# Altium project F4SDR.PrjPcb
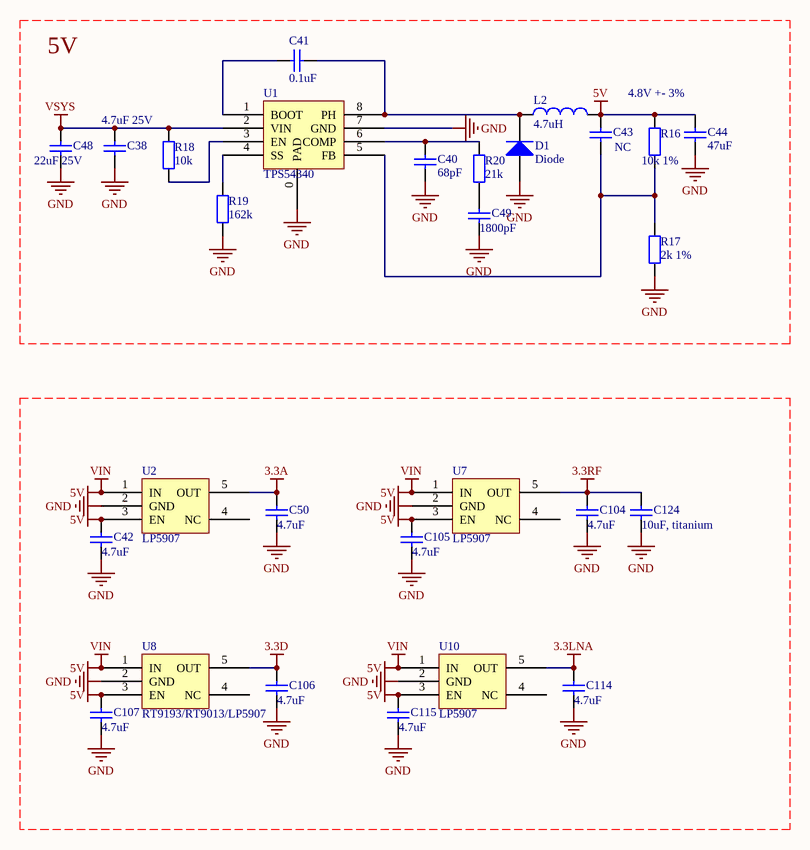
[diagram p0: power.SchDoc]
7 sheets, 238 parts. Net scope: flat (ports and power ports of the same name join across sheets).
Board file: F4SDR.PcbDoc
Sheets:
  power.SchDoc
  mcu.SchDoc
  IF.SchDoc
  MAX2829_RF.SchDoc
  PA.SchDoc
  USB_HS.SchDoc
  LNA.SchDoc

## Sheet power.SchDoc
size A4

### Parts
C38  value 4.7uF 25V  [0805]  (hidden comment: Cap)
C40  value 68pF  [0402]  (hidden comment: Cap)
C41  value 0.1uF  [0402]  (hidden comment: Cap)
C42  4.7uF  [0603]
C43  NC  [0402]
C44  value 47uF  [1210]  (hidden comment: Cap)
C48  value 22uF 25V  [1210]  (hidden comment: Cap)
C49  value 1800pF  [0402]  (hidden comment: Cap)
C50  4.7uF  [0603]
C104  4.7uF  [0603]
C105  4.7uF  [0603]
C106  4.7uF  [0603]
C107  4.7uF  [0603]
C114  4.7uF  [0603]
C115  4.7uF  [0603]
C124  10uF, titanium  [0805]
D1  Diode  [LC-SMB(DO-214AA)_S5]
L2  value 4.7uH  [L7022]  (hidden comment: Inductor)
R16  value 10k 1%  [0402]  (hidden comment: Res2)
R17  value 2k 1%  [0402]  (hidden comment: Res2)
R18  value 10k  [0402]  (hidden comment: Res2)
R19  value 162k  [0402]  (hidden comment: Res2)
R20  value 21k  [0402]  (hidden comment: Res2)
U1  TPS54340  [D8-Pad]
U2  LP5907  [SOT23-5]
U7  LP5907  [SOT23-5]
U8  RT9193/RT9013/LP5907  [SOT23-5]
U10  LP5907  [SOT23-5]

### Nets
3.3A: C50.2 U2.5(OUT)
3.3D: C106.2 U8.5(OUT)
3.3LNA: C114.2 U10.5(OUT)
3.3RF: C104.2 C124.2 U7.5(OUT)
5V: C42.2 C43.1 C44.1 C105.2 C107.2 C115.2 L2.2 R16.1 U2.1(IN) U2.3(EN) U7.1(IN) U7.3(EN) U8.1(IN) U8.3(EN) U10.1(IN) U10.3(EN)  [also labelled VIN]
GND: C38.2 C40.2 C42.1 C44.2 C48.2 C49.2 C50.1 C104.1 C105.1 C106.1 C107.1 C114.1 C115.1 C124.1 D1.1(A) R17.2 R19.2 U1.0(PAD) U1.7(GND) U2.2(GND) U7.2(GND) U8.2(GND) U10.2(GND)
VSYS: C38.1 C48.1 R18.1 U1.2(VIN)
NetC40_1: C40.1 R20.1 U1.6(COMP)
NetC41_1: C41.1 D1.2(K) L2.1 U1.8(PH)
NetC41_2: C41.2 U1.1(BOOT)
NetC43_2: C43.2 R16.2 R17.1 U1.5(FB)
NetC49_1: C49.1 R20.2
NetR18_2: R18.2 U1.3(EN)
NetR19_1: R19.1 U1.4(SS)

Not connected (* = marked no-connect by the designer): U2 4(NC); U7 4(NC); U8 4(NC); U10 4(NC)

### Notes on the sheet
- 5V
- 4.8V +- 3%

### Library data of the parts
C38 C40-C44 C48-C50 C104-C107 C114 C115 C124 = Cap: Capacitor; Published: 8-Jun-2000; LatestRevisionDate: 17-Jul-2002; LatestRevisionNote: Re-released for DXP Platform.; PackageReference: RAD-0.3; Publisher: Altium Limited; PackageDescription: Radial Cap, Thru-Hole; 2 Leads; 0.3 in Pin Spacing
D1 = Diode: Default Diode; Published: 8-Jun-2000; LatestRevisionDate: 17-Jul-2002; LatestRevisionNote: Re-released for DXP Platform.; PackageVersion: Sep-1996; PackageReference: SMC; Publisher: Altium Limited; PackageDescription: DO-214-AB/SMC; 2 C-Bend Leads; Body 7.9 x 5.9 mm, inc. leads (LxW); Code_JEDEC: DO-214-AB
L2 = Inductor: Code_IEC: 1005; Published: 8-Jun-2000; LatestRevisionDate: 29-May-2009; LatestRevisionNote: IPC-7351 Footprint Added.; PackageReference: 0402-A; Publisher: Altium Limited; PackageDescription: Chip Inductor; Code_JEITA: 0402
R16-R20 = Res2: Resistor; Published: 8-Jun-2000; LatestRevisionDate: 17-Jul-2002; LatestRevisionNote: Re-released for DXP Platform.; PackageReference: AXIAL-0.4; Publisher: Altium Limited; PackageDescription: Axial Device, Thru-Hole; 2 Leads; 0.4 in Pin Spacing
U8 = LP5907

## Sheet mcu.SchDoc
size A4
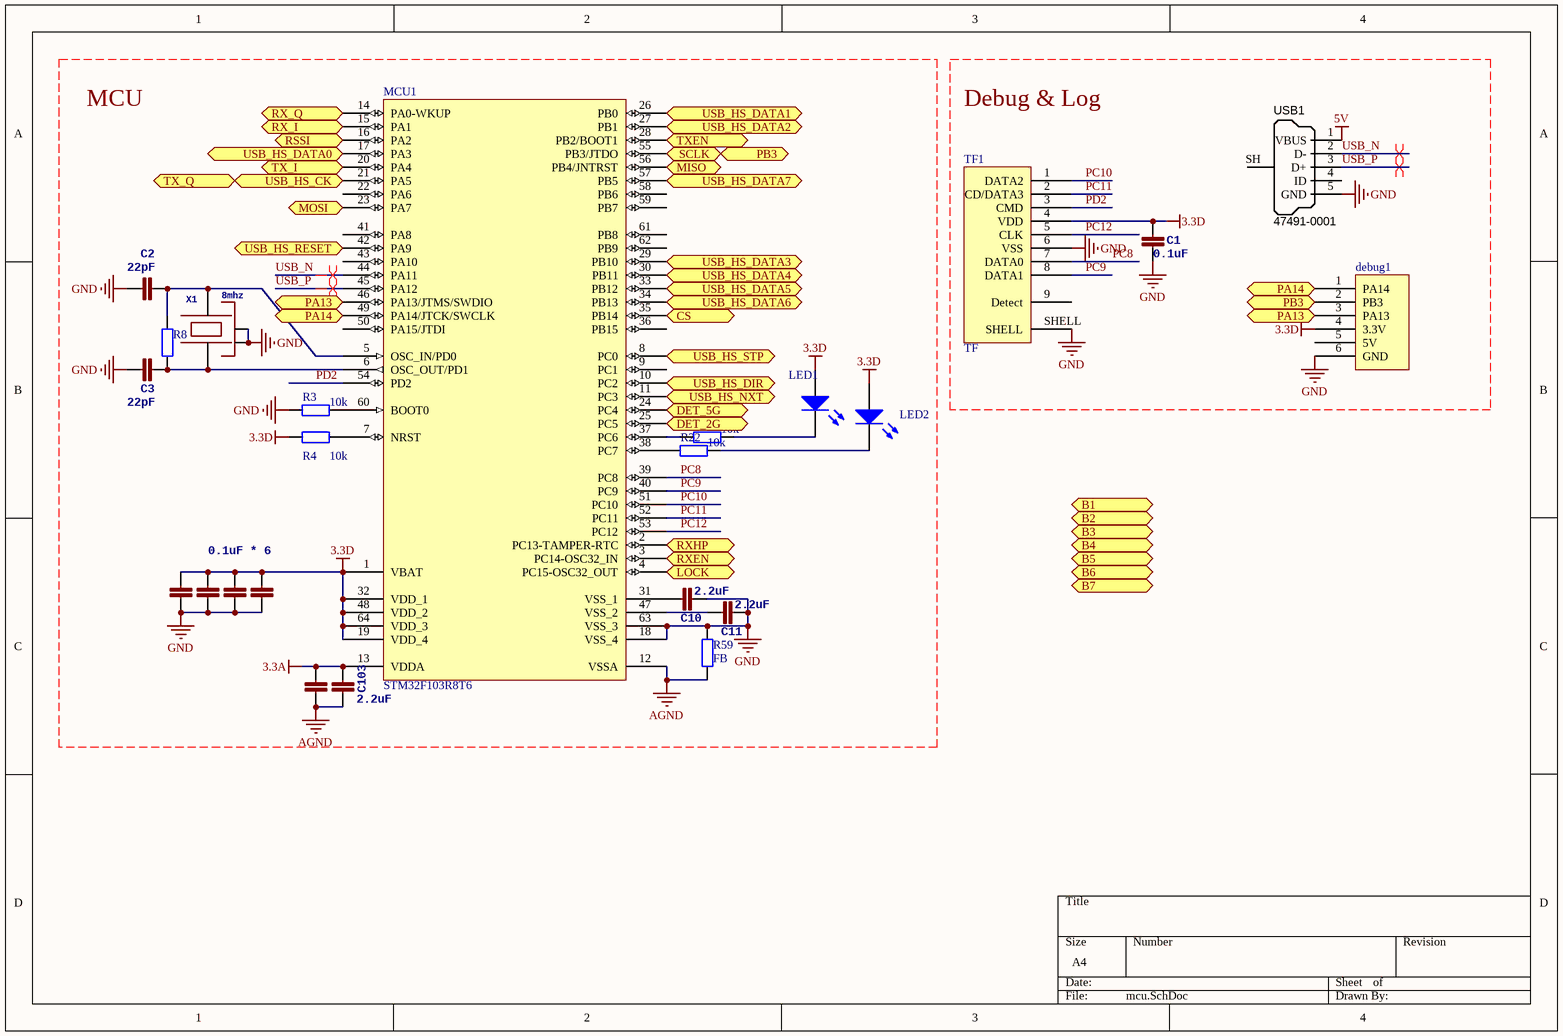
[diagram p1: mcu.SchDoc]

### Parts
C1  0.1uF  [0402]
C2  22pF  [0402]
C3  22pF  [0402]
C4  0.1uF * 6  [0402]
C5  1n  [0402]  (value not drawn)
C6  1n  [0402]  (value not drawn)
C7  1n  [0402]  (value not drawn)
C10  2.2uF  [0603]
C11  2.2uF  [0603]
C102  1n  [0402]  (value not drawn)
C103  2.2uF  [0603]
debug1  debug  [WFRSM125]  (value not drawn)
LED1  LED0  [0603]  (value not drawn)
LED2  LED0  [0603]  (value not drawn)
MCU1  STM32F103R8T6  [LQFP64_N]
R3  10k  [0402]
R4  10k  [0402]
R8  (no value)  [0402]
R21  10k  [0402]
R22  10k  [0402]
R59  FB  [0402]
TF1  TF  [TF]
USB1  Manufacturer Part Number 1: 47491-0001  [MICRO-YZX]  (hidden comment: USB Micro Type B)
X1  8mhz  [OSCILLATOR-3.2X2.5]

### Ports
B1, B2, B3, B4, B5, B6, B7, CS, DET_2G, DET_5G, LOCK, MISO, MOSI, PA13, PA14, PB3, RSSI, RX_I, RX_Q, RXEN, RXHP, SCLK, TX_I, TX_Q, TXEN, USB_HS_CK, USB_HS_DATA0, USB_HS_DATA1, USB_HS_DATA2, USB_HS_DATA3, USB_HS_DATA4, USB_HS_DATA5, USB_HS_DATA6, USB_HS_DATA7, USB_HS_DIR, USB_HS_NXT, USB_HS_RESET, USB_HS_STP

### Nets
3.3A: C102.2 C103.2 MCU1.13(VDDA)
3.3D: C1.2 C4.2 C5.2 C6.2 C7.2 debug1.4(3.3V) LED1.1(A) LED2.1(A) MCU1.1(VBAT) MCU1.19(VDD_4) MCU1.32(VDD_1) MCU1.48(VDD_2) MCU1.64(VDD_3) R4.2 TF1.4(VDD)
5V: USB1.1(VBUS)
AGND: C102.1 C103.1 MCU1.12(VSSA) R59.2
GND: C1.1 C2.2 C3.2 C4.1 C5.1 C6.1 C7.1 C10.2 C11.2 debug1.6(GND) MCU1.18(VSS_4) MCU1.63(VSS_3) R3.1 R59.1 TF1.6(VSS) TF1.SHELL USB1.5(GND) X1.2(NC_2) X1.4(NC_4)
PC8: MCU1.39(PC8) TF1.7(DATA0)
PC9: MCU1.40(PC9) TF1.8(DATA1)
PC10: MCU1.51(PC10) TF1.1(DATA2)
PC11: MCU1.52(PC11) TF1.2(CD/DATA3)
PC12: MCU1.53(PC12) TF1.5(CLK)
PD2: MCU1.54(PD2) TF1.3(CMD)
USB_N: MCU1.44(PA11) USB1.2(D-)
USB_P: MCU1.45(PA12) USB1.3(D+)
NetC2_1: C2.1 MCU1.5(OSC_IN/PD0) R8.2 X1.3
NetC3_1: C3.1 MCU1.6(OSC_OUT/PD1) R8.1 X1.1
NetC9_1: MCU1.15(PA1) ; port RX_I
NetC10_1: C10.1 MCU1.31(VSS_1)
NetC11_1: C11.1 MCU1.47(VSS_2)
NetC33_1: MCU1.25(PC5) ; port DET_2G
NetC58_1: MCU1.14(PA0-WKUP) ; port RX_Q
NetC123_1: MCU1.24(PC4) ; port DET_5G
Netdebug1_1: debug1.1(PA14) MCU1.49(PA14/JTCK/SWCLK) ; port PA14
Netdebug1_2: debug1.2(PB3) MCU1.55(PB3/JTDO) ; port SCLK, port PB3
Netdebug1_3: debug1.3(PA13) MCU1.46(PA13/JTMS/SWDIO) ; port PA13
NetLED1_2: LED1.2(K) R21.2
NetLED2_2: LED2.2(K) R22.2
NetMAX_13: MCU1.28(PB2/BOOT1) ; port TXEN
NetMAX_26: MCU1.23(PA7) ; port MOSI
NetMAX_28: MCU1.35(PB14) ; port CS
NetMAX_29: MCU1.4(PC15-OSC32_OUT) ; port LOCK
NetMAX_40: MCU1.16(PA2) ; port RSSI
NetMAX_41: MCU1.3(PC14-OSC32_IN) ; port RXEN
NetMAX_42: MCU1.2(PC13-TAMPER-RTC) ; port RXHP
NetMCU1_7: MCU1.7(NRST) R4.1
NetMCU1_8: MCU1.8(PC0) ; port USB_HS_STP
NetMCU1_10: MCU1.10(PC2) ; port USB_HS_DIR
NetMCU1_11: MCU1.11(PC3) ; port USB_HS_NXT
NetMCU1_17: MCU1.17(PA3) ; port USB_HS_DATA0
NetMCU1_20: MCU1.20(PA4) ; port TX_I
NetMCU1_21: MCU1.21(PA5) ; port USB_HS_CK, port TX_Q
NetMCU1_26: MCU1.26(PB0) ; port USB_HS_DATA1
NetMCU1_27: MCU1.27(PB1) ; port USB_HS_DATA2
NetMCU1_29: MCU1.29(PB10) ; port USB_HS_DATA3
NetMCU1_30: MCU1.30(PB11) ; port USB_HS_DATA4
NetMCU1_33: MCU1.33(PB12) ; port USB_HS_DATA5
NetMCU1_34: MCU1.34(PB13) ; port USB_HS_DATA6
NetMCU1_37: MCU1.37(PC6) R21.1
NetMCU1_38: MCU1.38(PC7) R22.1
NetMCU1_42: MCU1.42(PA9) ; port USB_HS_RESET
NetMCU1_56: MCU1.56(PB4/JNTRST) ; port MISO
NetMCU1_57: MCU1.57(PB5) ; port USB_HS_DATA7
NetMCU1_60: MCU1.60(BOOT0) R3.2

Not connected (* = marked no-connect by the designer): debug1 5(5V); MCU1 9(PC1) 22(PA6) 36(PB15) 41(PA8) 43(PA10) 50(PA15/JTDI) 58(PB6) 59(PB7) 61(PB8) 62(PB9); TF1 9(Detect); USB1 4(ID) SH(Shell)

### Layout directives
differential pair: USB_N, USB_P

### Notes on the sheet
- MCU
- Debug & Log

### Library data of the parts
C1-C7 C10 C11 C102 C103 = CAP0402-CAP: <b>Capacitor</b> / Standard 0603 ceramic capacitor, and 0.1" leaded capacitor.; PARTNO: CC0402ZRY5V7BB104
LED1 LED2 = LED0: Typical INFRARED GaAs LED; Published: 8-Jun-2000; LatestRevisionDate: 08-Jul-2005; LatestRevisionNote: Mech Layer 1 removed.; PackageReference: LED-0; Publisher: Altium Limited; PackageDescription: LED; 2 Leads
MCU1 = STM32F103R8T6: STM32 ARM-based 32-bit MCU with 64 Kbytes Flash, 64-pin LQFP, Industrial Temperature; Published: *; DatasheetVersion: *; PackageVersion: *; PackageReference: *; Publisher: *; PackageDescription: *; ComponentLink1Description: *; ComponentLink1URL: *; ComponentLink2Description: *; ComponentLink2URL: *
R3 R4 R8 R21 R22 R59 = Res2: Resistor; Value: 0Ohm; Published: 8-Jun-2000; LatestRevisionDate: 17-Jul-2002; LatestRevisionNote: Re-released for DXP Platform.; PackageReference: AXIAL-0.4; Publisher: Altium Limited; PackageDescription: Axial Device, Thru-Hole; 2 Leads; 0.4 in Pin Spacing
USB1 = USB_Micro_TypeB: Connector SMD USB Micro Type B middle mount; Manufacturer 1: Molex Inc; SCDType: undef; Package / Case: SMD; Supplier 1: Digi-Key; Supplier Part Number 1: WM17142CT-ND
X1 = OSCILLATOR-3.2X2.5: Crystal Oscillator in 3.2x2.5 SMD

## Sheet IF.SchDoc
size A3
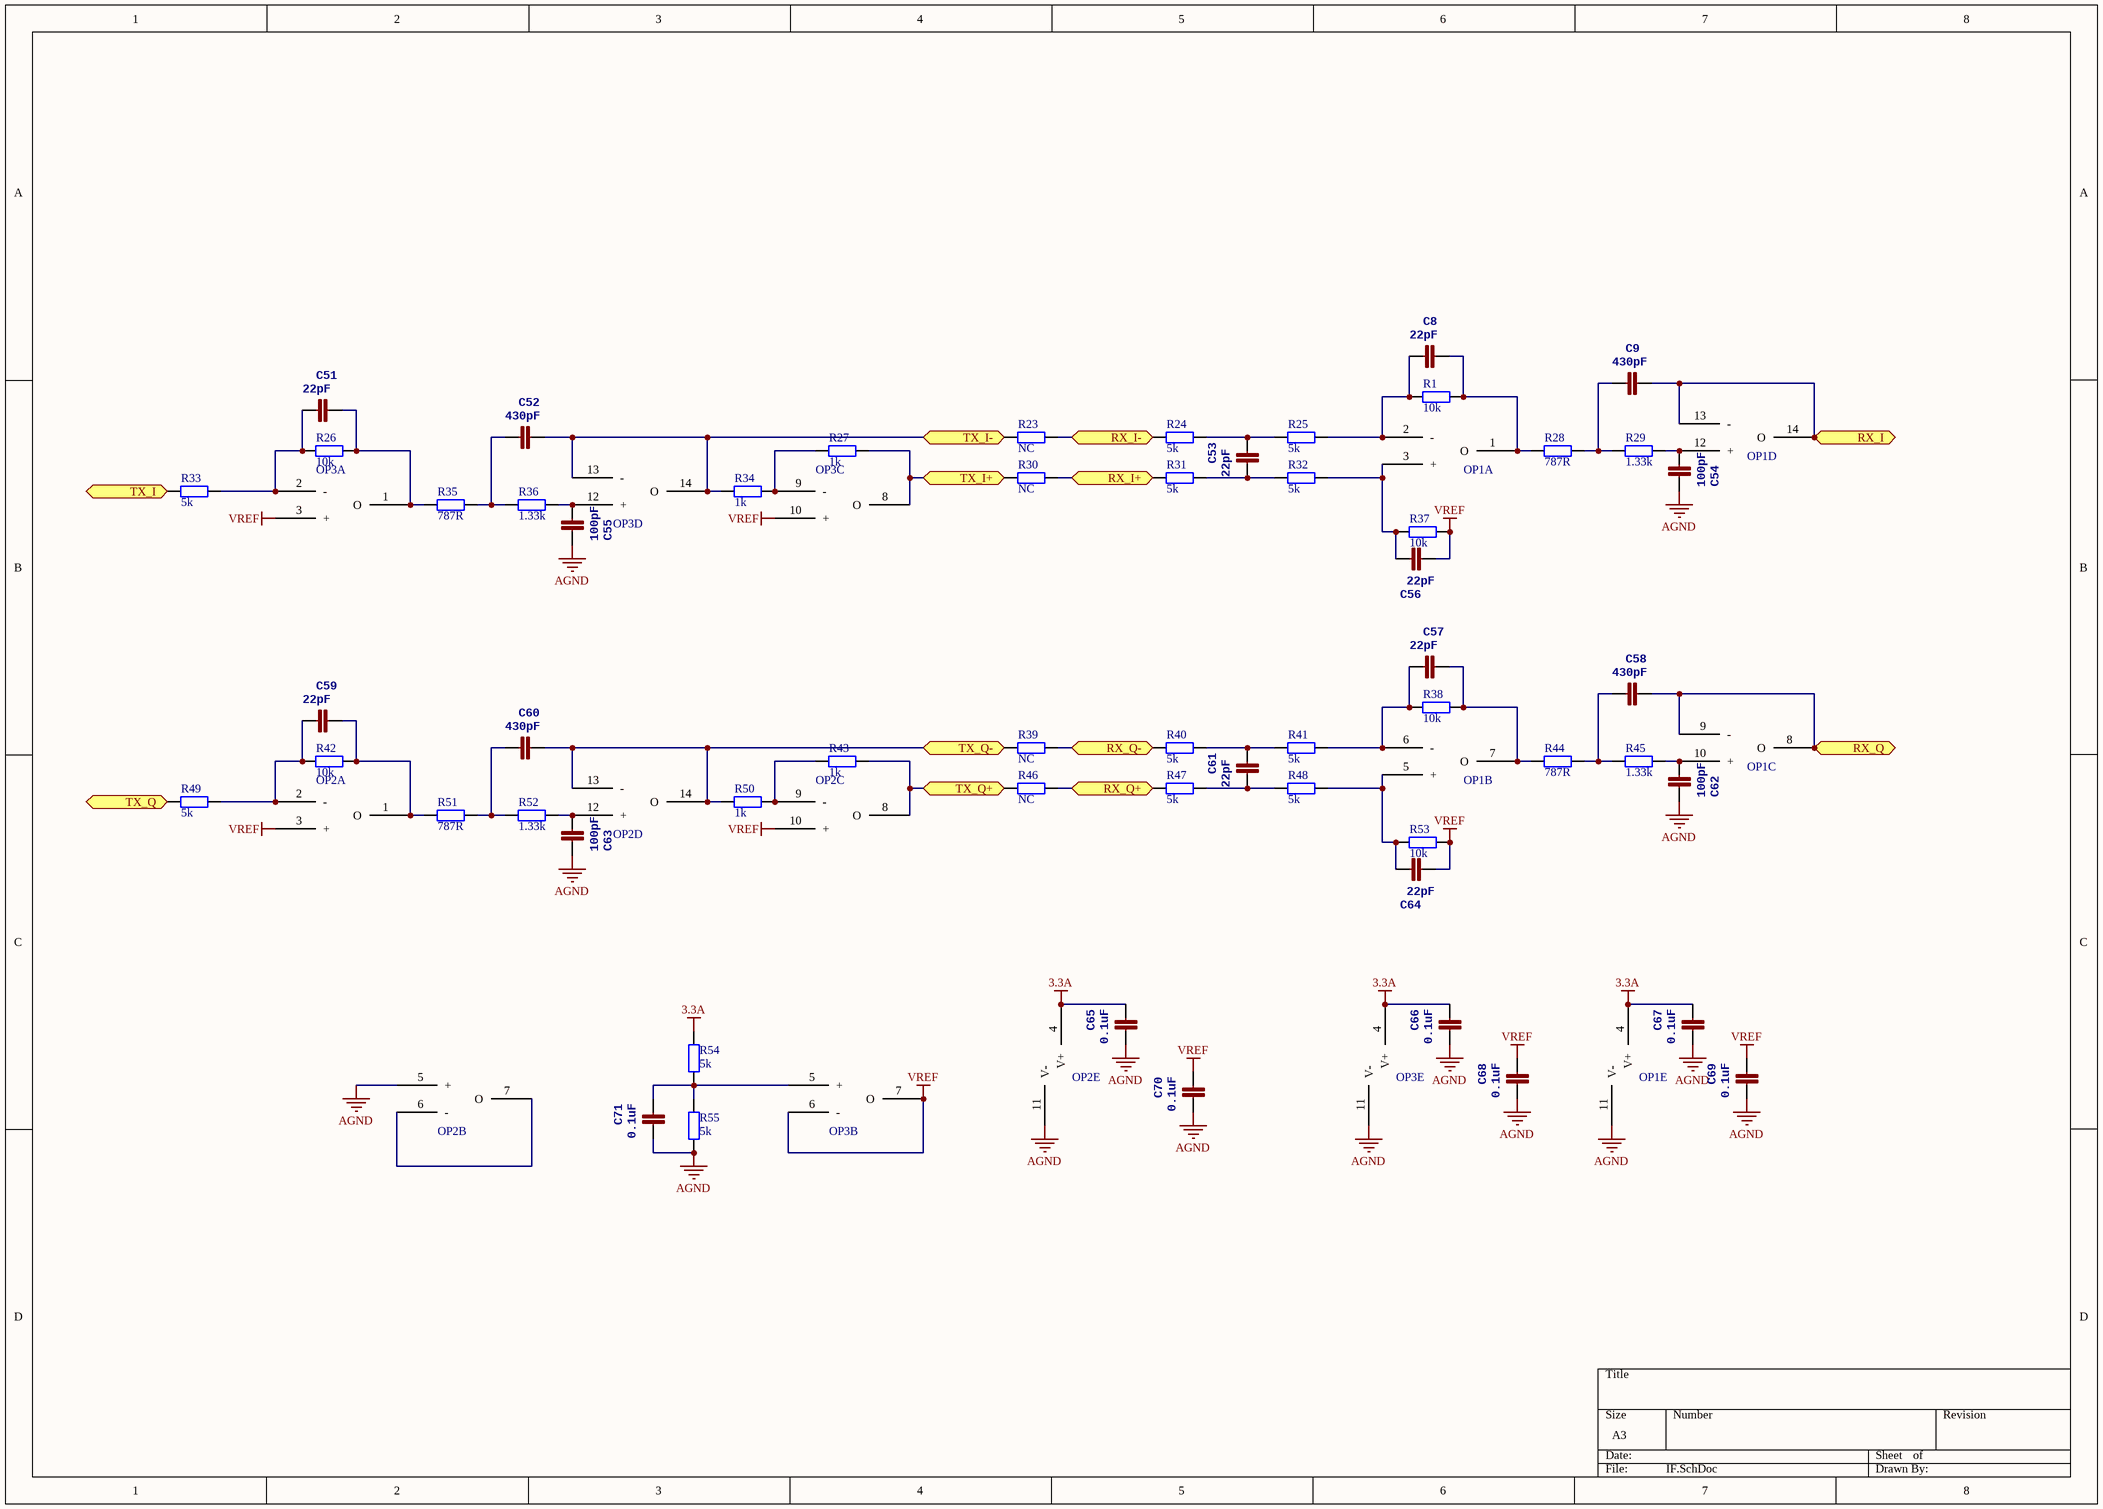
[diagram p2: IF.SchDoc]

### Parts
C8  22pF  [0402]
C9  430pF  [0402]
C51  22pF  [0402]
C52  430pF  [0402]
C53  22pF  [0402]
C54  100pF  [0402]
C55  100pF  [0402]
C56  22pF  [0402]
C57  22pF  [0402]
C58  430pF  [0402]
C59  22pF  [0402]
C60  430pF  [0402]
C61  22pF  [0402]
C62  100pF  [0402]
C63  100pF  [0402]
C64  22pF  [0402]
C65  0.1uF  [0402]
C66  0.1uF  [0402]
C67  0.1uF  [0402]
C68  0.1uF  [0402]
C69  0.1uF  [0402]
C70  0.1uF  [0402]
C71  0.1uF  [0402]
OP1  MCP6024  (value not drawn)  (parts A,B,C,D,E of 5)
OP2  MCP6024  (value not drawn)  (parts A,B,C,D,E of 5)
OP3  MCP6024  (value not drawn)  (parts A,B,C,D,E of 5)
R1  10k  [0402]
R23  NC  [0402]
R24  5k  [0402]
R25  5k  [0402]
R26  10k  [0402]
R27  1k  [0402]
R28  787R  [0402]
R29  1.33k  [0402]
R30  NC  [0402]
R31  5k  [0402]
R32  5k  [0402]
R33  5k  [0402]
R34  1k  [0402]
R35  787R  [0402]
R36  1.33k  [0402]
R37  10k  [0402]
R38  10k  [0402]
R39  NC  [0402]
R40  5k  [0402]
R41  5k  [0402]
R42  10k  [0402]
R43  1k  [0402]
R44  787R  [0402]
R45  1.33k  [0402]
R46  NC  [0402]
R47  5k  [0402]
R48  5k  [0402]
R49  5k  [0402]
R50  1k  [0402]
R51  787R  [0402]
R52  1.33k  [0402]
R53  10k  [0402]
R54  5k  [0402]
R55  5k  [0402]

### Ports
RX_I, RX_I+, RX_I-, RX_Q, RX_Q+, RX_Q-, TX_I, TX_I+, TX_I-, TX_Q, TX_Q+, TX_Q-

### Nets
3.3A: C65.1 C66.1 C67.1 OP1.4(V+) OP2.4(V+) OP3.4(V+) R54.1
AGND: C54.1 C55.1 C62.1 C63.1 C65.2 C66.2 C67.2 C68.2 C69.2 C70.2 C71.2 OP1.11(V-) OP2.5(+) OP2.11(V-) OP3.11(V-) R55.2
VREF: C56.2 C64.2 C68.1 C69.1 C70.1 OP2.3(+) OP2.10(+) OP3.3(+) OP3.6(-) OP3.7(O) OP3.10(+) R37.1 R53.1
NetC8_1: C8.1 OP1.1(O) R1.1 R28.2
NetC8_2: C8.2 OP1.2(-) R1.2 R25.1
NetC9_1: C9.1 OP1.13(-) OP1.14(O) ; port RX_I
NetC9_2: C9.2 R28.1 R29.2
NetC51_1: C51.1 OP3.1(O) R26.1 R35.2
NetC51_2: C51.2 OP3.2(-) R26.2 R33.1
NetC52_1: C52.1 OP3.13(-) OP3.14(O) R23.2 R34.2 ; port TX_I-
NetC52_2: C52.2 R35.1 R36.2
NetC53_1: C53.1 R24.1 R25.2
NetC53_2: C53.2 R31.1 R32.2
NetC54_2: C54.2 OP1.12(+) R29.1
NetC55_2: C55.2 OP3.12(+) R36.1
NetC56_1: C56.1 OP1.3(+) R32.1 R37.2
NetC57_1: C57.1 OP1.7(O) R38.1 R44.2
NetC57_2: C57.2 OP1.6(-) R38.2 R41.1
NetC58_1: C58.1 OP1.8(O) OP1.9(-) ; port RX_Q
NetC58_2: C58.2 R44.1 R45.2
NetC59_1: C59.1 OP2.1(O) R42.1 R51.2
NetC59_2: C59.2 OP2.2(-) R42.2 R49.1
NetC60_1: C60.1 OP2.13(-) OP2.14(O) R39.2 R50.2 ; port TX_Q-
NetC60_2: C60.2 R51.1 R52.2
NetC61_1: C61.1 R40.1 R41.2
NetC61_2: C61.2 R47.1 R48.2
NetC62_2: C62.2 OP1.10(+) R45.1
NetC63_2: C63.2 OP2.12(+) R52.1
NetC64_1: C64.1 OP1.5(+) R48.1 R53.2
NetC71_1: C71.1 OP3.5(+) R54.2 R55.1
NetMAX_16: OP3.8(O) R27.1 R30.2 ; port TX_I+
NetMAX_18: OP2.8(O) R43.1 R46.2 ; port TX_Q+
NetMAX_43: R39.1 R40.2 ; port RX_Q-
NetMAX_44: R46.1 R47.2 ; port RX_Q+
NetMAX_45: R23.1 R24.2 ; port RX_I-
NetMAX_46: R30.1 R31.2 ; port RX_I+
NetMCU1_20: R33.2 ; port TX_I
NetMCU1_21: R49.2 ; port TX_Q
NetOP2_6: OP2.6(-) OP2.7(O)
NetOP2_9: OP2.9(-) R43.2 R50.1
NetOP3_9: OP3.9(-) R27.2 R34.1

### Library data of the parts
C8 C9 C51-C71 = CAP0402-CAP: as C1 on sheet mcu
OP1-OP3 = OP-SOP14
R1 R23-R55 = Res2: Resistor; Published: 8-Jun-2000; LatestRevisionDate: 17-Jul-2002; LatestRevisionNote: Re-released for DXP Platform.; PackageReference: AXIAL-0.4; Publisher: Altium Limited; PackageDescription: Axial Device, Thru-Hole; 2 Leads; 0.4 in Pin Spacing

## Sheet MAX2829_RF.SchDoc
size A4
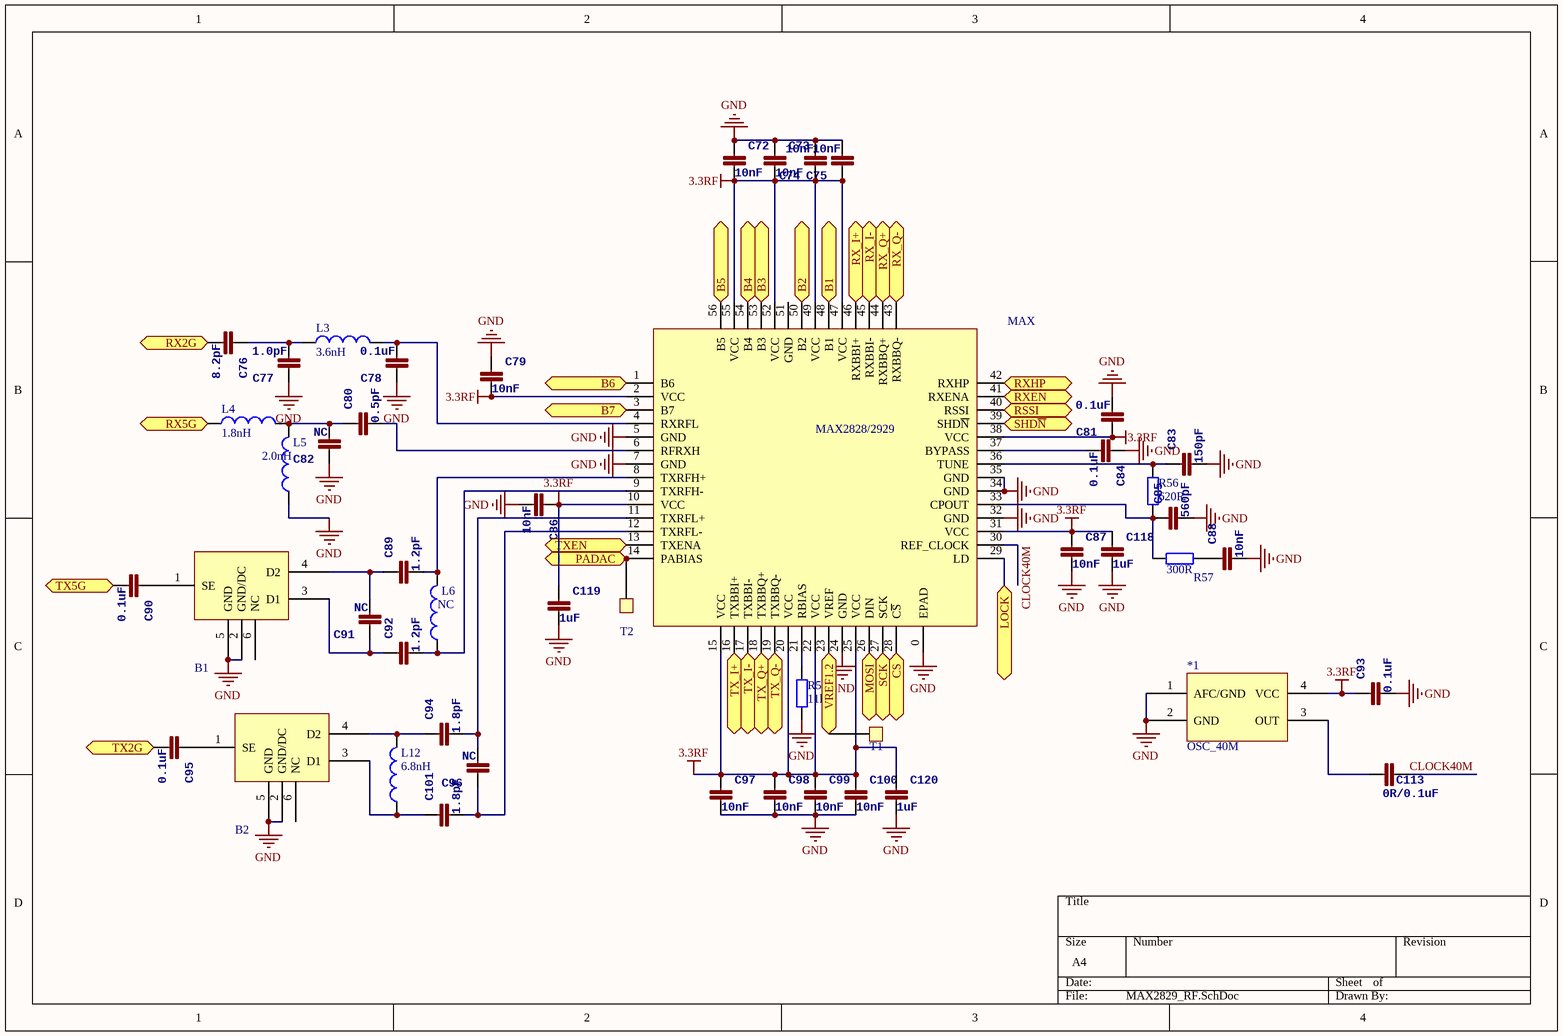
[diagram p3: MAX2829_RF.SchDoc]

### Parts
*1  OSC_40M  [TXC_7Q]
B1  Balun  [HHM1711D1/HHM1732B1]  (value not drawn)
B2  Balun  [HHM1711D1/HHM1732B1]  (value not drawn)
C72  10nF  [0402]
C73  10nF  [0402]
C74  10nF  [0402]
C75  10nF  [0402]
C76  8.2pF  [0402]
C77  1.0pF  [0402]
C78  0.1uF  [0402]
C79  10nF  [0402]
C80  0.5pF  [0402]
C81  0.1uF  [0402]
C82  NC  [0402]
C83  150pF  [0402]
C84  0.1uF  [0402]
C85  560pF  [0402]
C86  10nF  [0402]
C87  10nF  [0402]
C88  10nF  [0402]
C89  1.2pF  [0402]
C90  0.1uF  [0402]
C91  NC  [0402]
C92  1.2pF  [0402]
C93  0.1uF  [0402]
C94  1.8pF  [0402]
C95  0.1uF  [0402]
C96  NC  [0402]
C97  10nF  [0402]
C98  10nF  [0402]
C99  10nF  [0402]
C100  10nF  [0402]
C101  1.8pF  [0402]
C113  0R/0.1uF  [0402]
C118  1uF  [0603]
C119  1uF  [0603]
C120  1uF  [0603]
L3  value 3.6nH  [0402]  (hidden comment: Inductor)
L4  value 1.8nH  [0402]  (hidden comment: Inductor)
L5  2.0nH  [0402]
L6  NC  [0402]
L12  value 6.8nH  [0402]  (hidden comment: Inductor)
MAX  MAX2828/2929  [QFN_56\MAX2829]
R56  620R  [0402]
R57  300R  [0402]
R58  11k  [0402]
T1  TestPad  [TestPad - 1mm]  (value not drawn)
T2  TestPad  [TestPad - 1mm]  (value not drawn)

### Ports
B1, B2, B3, B4, B5, B6, B7, CS, LOCK, MOSI, PADAC, RSSI, RX2G, RX5G, RX_I+, RX_I-, RX_Q+, RX_Q-, RXEN, RXHP, SCK, SHD~{N}, TX2G, TX5G, TX_I+, TX_I-, TX_Q+, TX_Q-, TXEN, VREF1.2

### Nets
3.3RF: *1.4(VCC) C72.2 C73.2 C74.1 C75.1 C79.2 C81.1 C86.1 C87.1 C93.1 C97.1 C98.1 C99.1 C100.1 C118.1 C119.1 C120.1 MAX.2(VCC) MAX.10(VCC) MAX.15(VCC) MAX.20(VCC) MAX.22(VCC) MAX.25(VCC) MAX.31(VCC) MAX.38(VCC) MAX.47(VCC) MAX.49(VCC) MAX.52(VCC) MAX.55(VCC)
GND: *1.1(AFC/GND) *1.2(GND) B1.2(GND/DC) B1.5(GND) B2.2(GND/DC) B2.5(GND) C72.1 C73.1 C74.2 C75.2 C77.1 C78.1 C79.1 C81.2 C82.1 C83.2 C84.1 C85.2 C86.2 C87.2 C88.2 C93.2 C97.2 C98.2 C99.2 C100.2 C118.2 C119.2 C120.2 L5.1 MAX.0(EPAD) MAX.5(GND) MAX.7(GND) MAX.24(GND) MAX.32(GND) MAX.34(GND) MAX.35(GND) R58.1
CLOCK40M: C113.2 MAX.30(REF_CLOCK)
Net*1_3: *1.3(OUT) C113.1
NetB1_1: B1.1(SE) C90.1
NetB1_3: B1.3(D1) C91.1 C92.1
NetB1_4: B1.4(D2) C89.1 C91.2
NetB2_1: B2.1(SE) C95.1
NetB2_3: B2.3(D1) C101.1 L12.1
NetB2_4: B2.4(D2) C94.1 L12.2
NetC18_1: C76.2 ; port RX2G
NetC47_2: L4.1 ; port RX5G
NetC52_1: MAX.17(TXBBI-) ; port TX_I-
NetC60_1: MAX.19(TXBBQ-) ; port TX_Q-
NetC76_1: C76.1 C77.2 L3.1
NetC78_2: C78.2 L3.2 MAX.4(RXRFL)
NetC80_1: C80.1 C82.2 L4.2 L5.2
NetC80_2: C80.2 MAX.6(RFRXH)
NetC83_1: C83.1 MAX.36(TUNE) R56.1
NetC84_2: C84.2 MAX.37(BYPASS)
NetC85_1: C85.1 MAX.33(CPOUT) R56.2 R57.1
NetC88_1: C88.1 R57.2
NetC89_2: C89.2 L6.2 MAX.8(TXRFH+)
NetC90_2: C90.2 ; port TX5G
NetC92_2: C92.2 L6.1 MAX.9(TXRFH-)
NetC94_2: C94.2 C96.2 MAX.11(TXRFL+)
NetC95_2: C95.2 ; port TX2G
NetC96_1: C96.1 C101.2 MAX.12(TXRFL-)
NetMAX_1: MAX.1(B6) ; port B6
NetMAX_3: MAX.3(B7) ; port B7
NetMAX_13: MAX.13(TXENA) ; port TXEN
NetMAX_14: MAX.14(PABIAS) T2.1 ; port PADAC
NetMAX_16: MAX.16(TXBBI+) ; port TX_I+
NetMAX_18: MAX.18(TXBBQ+) ; port TX_Q+
NetMAX_21: MAX.21(RBIAS) R58.2
NetMAX_23: MAX.23(VREF) T1.1 ; port VREF1.2
NetMAX_26: MAX.26(DIN) ; port MOSI
NetMAX_27: MAX.27(SCK) ; port SCK
NetMAX_28: MAX.28(C~{S}) ; port CS
NetMAX_29: MAX.29(LD) ; port LOCK
NetMAX_39: MAX.39(SHD~{N}) ; port SHD~{N}
NetMAX_40: MAX.40(RSSI) ; port RSSI
NetMAX_41: MAX.41(RXENA) ; port RXEN
NetMAX_42: MAX.42(RXHP) ; port RXHP
NetMAX_43: MAX.43(RXBBQ-) ; port RX_Q-
NetMAX_44: MAX.44(RXBBQ+) ; port RX_Q+
NetMAX_45: MAX.45(RXBBI-) ; port RX_I-
NetMAX_46: MAX.46(RXBBI+) ; port RX_I+
NetMAX_48: MAX.48(B1) ; port B1
NetMAX_50: MAX.50(B2) ; port B2
NetMAX_53: MAX.53(B3) ; port B3
NetMAX_54: MAX.54(B4) ; port B4
NetMAX_56: MAX.56(B5) ; port B5

Not connected (* = marked no-connect by the designer): B1 6(NC); B2 6(NC); MAX 51(GND)

### Library data of the parts
C72-C101 C113 C118-C120 = CAP0402-CAP: as C1 on sheet mcu
L3-L6 L12 = Inductor: Code_IEC: 1005; Published: 8-Jun-2000; LatestRevisionDate: 29-May-2009; LatestRevisionNote: IPC-7351 Footprint Added.; PackageReference: 0402-A; Publisher: Altium Limited; PackageDescription: Chip Inductor; Code_JEITA: 0402
R56-R58 = Res2: Resistor; Published: 8-Jun-2000; LatestRevisionDate: 17-Jul-2002; LatestRevisionNote: Re-released for DXP Platform.; PackageReference: AXIAL-0.4; Publisher: Altium Limited; PackageDescription: Axial Device, Thru-Hole; 2 Leads; 0.4 in Pin Spacing

## Sheet PA.SchDoc
size A4
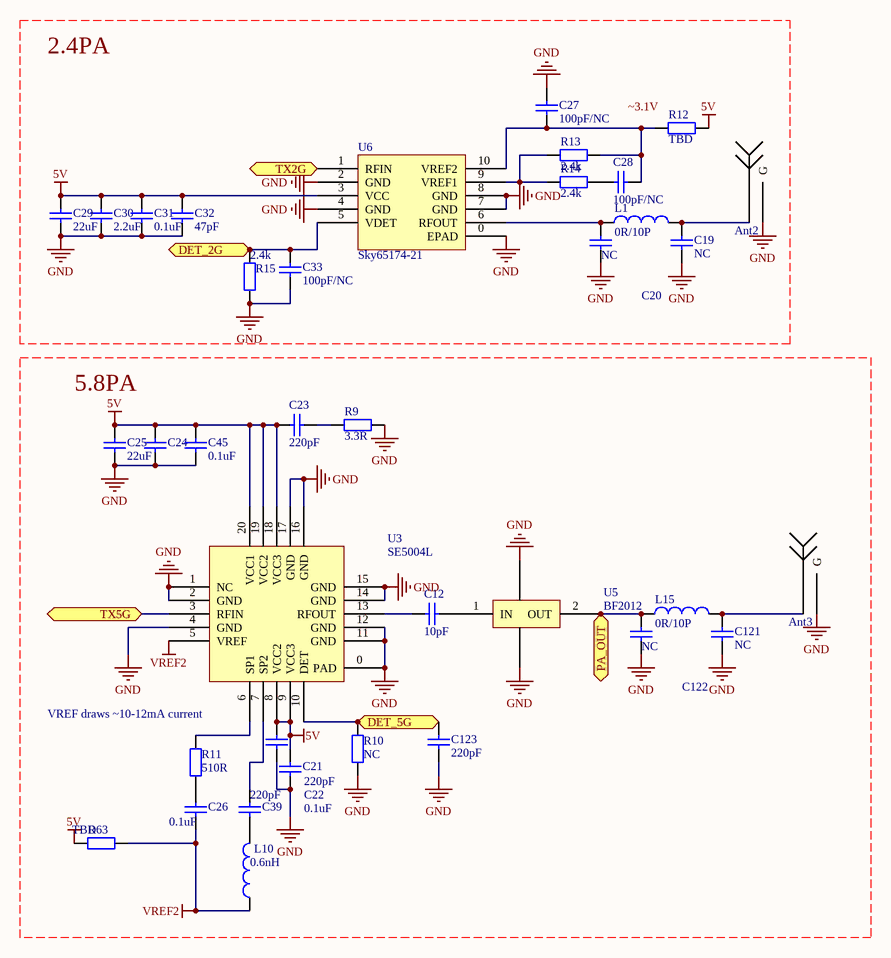
[diagram p4: PA.SchDoc]

### Parts
Ant2  Antenna  [SMA-2]  (value not drawn)
Ant3  Antenna  [SMA-2]  (value not drawn)
C12  value 10pF  [0402]  (hidden comment: Cap)
C19  value NC  [0402]  (hidden comment: Cap)
C20  value NC  [0402]  (hidden comment: Cap)
C21  value 0.1uF  [0402]  (hidden comment: Cap)
C22  value 220pF  [0402]  (hidden comment: Cap)
C23  value 220pF  [0402]  (hidden comment: Cap)
C24  1uF  [0603]  (value not drawn)
C25  value 22uF  [0805]  (hidden comment: Cap)
C26  value 0.1uF  [0402]  (hidden comment: Cap)
C27  value 100pF/NC  [0402]  (hidden comment: Cap)
C28  value 100pF/NC  [0402]  (hidden comment: Cap)
C29  value 22uF  [0805]  (hidden comment: Cap)
C30  value 2.2uF  [0603]  (hidden comment: Cap)
C31  value 0.1uF  [0402]  (hidden comment: Cap)
C32  value 47pF  [0402]  (hidden comment: Cap)
C33  value 100pF/NC  [0402]  (hidden comment: Cap)
C39  value 220pF  [0402]  (hidden comment: Cap)
C45  value 0.1uF  [0402]  (hidden comment: Cap)
C121  value NC  [0402]  (hidden comment: Cap)
C122  value NC  [0402]  (hidden comment: Cap)
C123  value 220pF  [0402]  (hidden comment: Cap)
L1  value 0R/10P  [0402]  (hidden comment: Inductor)
L10  value 0.6nH  [0402]  (hidden comment: Inductor)
L15  value 0R/10P  [0402]  (hidden comment: Inductor)
R9  value 3.3R  [0402]  (hidden comment: Res2)
R10  value NC  [0402]  (hidden comment: Res2)
R11  value 510R  [0402]  (hidden comment: Res2)
R12  value TBD  [0402]  (hidden comment: Res2)
R13  value 2.4k  [0402]  (hidden comment: Res2)
R14  value 2.4k  [0402]  (hidden comment: Res2)
R15  value 2.4k  [0402]  (hidden comment: Res2)
R63  TBD  [0603]
U3  SE5004L  [SE5004L]
U5  BF2012  [LFB2H5]
U6  Sky65174-21  [SKY65174-21]

### Ports
DET_2G, DET_5G, PA_OUT, TX2G, TX5G

### Nets
5V: C21.2 C22.2 C23.2 C24.1 C25.2 C29.1 C30.1 C31.1 C32.1 C45.1 R12.1 R63.2 U3.8(VCC2) U3.9(VCC3) U3.18(VCC3) U3.19(VCC2) U3.20(VCC1) U6.3(VCC)
GND: Ant2.GND(G) Ant3.GND(G) C19.2 C20.2 C21.1 C22.1 C24.2 C25.1 C27.1 C29.2 C30.2 C31.2 C32.2 C33.2 C45.2 C121.2 C122.2 C123.2 R9.1 R10.1 R15.1 U3.0(PAD) U3.1(NC) U3.2(GND) U3.4(GND) U3.11(GND) U3.12(GND) U3.14(GND) U3.15(GND) U3.16(GND) U3.17(GND) U5.0(GND) U6.0(EPAD) U6.2(GND) U6.4(GND) U6.7(GND) U6.8(GND)
VREF2: C26.1 L10.1 R63.1 U3.5(VREF)
NetAnt2_1: Ant2.1 C19.1 L1.2
NetAnt3_1: Ant3.1 C121.1 L15.2
NetC12_1: C12.1 U3.13(RFOUT)
NetC12_2: C12.2 U5.1(IN)
NetC20_1: C20.1 L1.1 U6.6(RFOUT)
NetC23_1: C23.1 R9.2
NetC26_2: C26.2 R11.1
NetC27_2: C27.2 C28.2 R12.2 R13.1 U6.10(VREF2)
NetC28_1: C28.1 R14.1
NetC33_1: C33.1 R15.2 U6.5(VDET) ; port DET_2G
NetC39_1: C39.1 L10.2
NetC39_2: C39.2 U3.7(SP2)
NetC90_2: U3.3(RFIN) ; port TX5G
NetC95_2: U6.1(RFIN) ; port TX2G
NetC122_1: C122.1 L15.1 U5.2(OUT) ; port PA_OUT
NetC123_1: C123.1 R10.2 U3.10(DET) ; port DET_5G
NetR11_2: R11.2 U3.6(SP1)
NetR13_2: R13.2 R14.2 U6.9(VREF1)

### Notes on the sheet
- 2.4PA
- 5.8PA
- VREF draws ~10-12mA current
- Labels drawn without touching a wire or pin: ~3.1V

### Library data of the parts
C12 C19-C33 C39 C45 C121-C123 = Cap: Capacitor; Published: 8-Jun-2000; LatestRevisionDate: 17-Jul-2002; LatestRevisionNote: Re-released for DXP Platform.; PackageReference: RAD-0.3; Publisher: Altium Limited; PackageDescription: Radial Cap, Thru-Hole; 2 Leads; 0.3 in Pin Spacing
L1 L10 L15 = Inductor: Code_IEC: 1005; Published: 8-Jun-2000; LatestRevisionDate: 29-May-2009; LatestRevisionNote: IPC-7351 Footprint Added.; PackageReference: 0402-A; Publisher: Altium Limited; PackageDescription: Chip Inductor; Code_JEITA: 0402
R9-R15 R63 = Res2: Resistor; Published: 8-Jun-2000; LatestRevisionDate: 17-Jul-2002; LatestRevisionNote: Re-released for DXP Platform.; PackageReference: AXIAL-0.4; Publisher: Altium Limited; PackageDescription: Axial Device, Thru-Hole; 2 Leads; 0.4 in Pin Spacing

## Sheet USB_HS.SchDoc
size A4
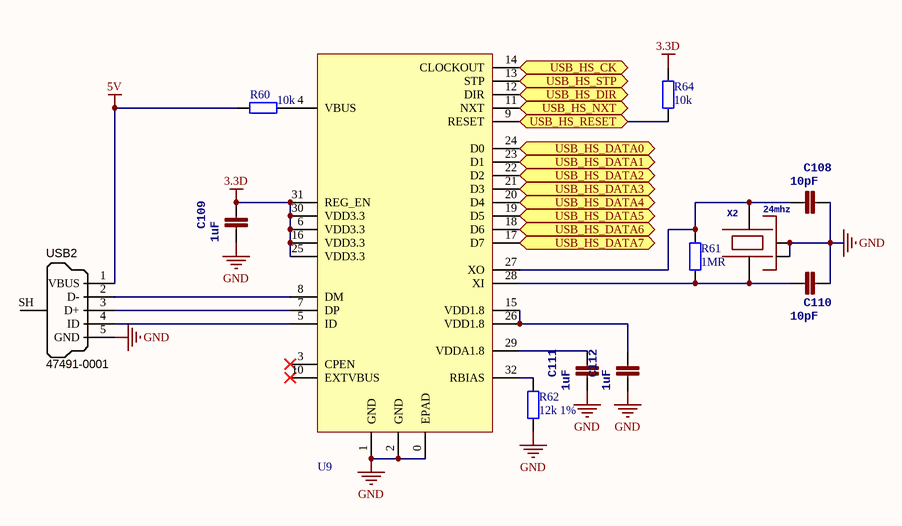
[diagram p5: USB_HS.SchDoc]

### Parts
C108  10pF  [0402]
C109  1uF  [0402]
C110  10pF  [0402]
C111  1uF  [0402]
C112  1uF  [0402]
R60  10k  [0402]
R61  1MR  [0402]
R62  12k 1%  [0402]
R64  10k  [0402]
U9  USB3300_1  [USB3300]  (value not drawn)
USB2  Manufacturer Part Number 1: 47491-0001  [MICRO-YZX]  (hidden comment: USB Micro Type B)
X2  24mhz  [OSCILLATOR-3.2X2.5]

### Ports
USB_HS_CK, USB_HS_DATA0, USB_HS_DATA1, USB_HS_DATA2, USB_HS_DATA3, USB_HS_DATA4, USB_HS_DATA5, USB_HS_DATA6, USB_HS_DATA7, USB_HS_DIR, USB_HS_NXT, USB_HS_RESET, USB_HS_STP

### Nets
3.3D: C109.1 R64.2 U9.6(VDD3.3) U9.16(VDD3.3) U9.25(VDD3.3) U9.30(VDD3.3) U9.31(REG_EN)
5V: R60.1 USB2.1(VBUS)
GND: C108.1 C109.2 C110.1 C111.2 C112.2 R62.1 U9.0(EPAD) U9.1(GND) U9.2(GND) USB2.5(GND) X2.2(NC_2) X2.4(NC_4)
NetC108_2: C108.2 R61.2 U9.27(XO) X2.3
NetC110_2: C110.2 R61.1 U9.28(XI) X2.1
NetC111_1: C111.1 U9.29(VDDA1.8)
NetC112_1: C112.1 U9.15(VDD1.8) U9.26(VDD1.8)
NetMCU1_8: U9.13(STP) ; port USB_HS_STP
NetMCU1_10: U9.12(DIR) ; port USB_HS_DIR
NetMCU1_11: U9.11(NXT) ; port USB_HS_NXT
NetMCU1_17: U9.24(D0) ; port USB_HS_DATA0
NetMCU1_21: U9.14(CLOCKOUT) ; port USB_HS_CK
NetMCU1_26: U9.23(D1) ; port USB_HS_DATA1
NetMCU1_27: U9.22(D2) ; port USB_HS_DATA2
NetMCU1_29: U9.21(D3) ; port USB_HS_DATA3
NetMCU1_30: U9.20(D4) ; port USB_HS_DATA4
NetMCU1_33: U9.19(D5) ; port USB_HS_DATA5
NetMCU1_34: U9.18(D6) ; port USB_HS_DATA6
NetMCU1_42: R64.1 U9.9(RESET) ; port USB_HS_RESET
NetMCU1_57: U9.17(D7) ; port USB_HS_DATA7
NetR60_2: R60.2 U9.4(VBUS)
NetR62_2: R62.2 U9.32(RBIAS)
NetU9_5: U9.5(ID) USB2.4(ID)
NetU9_7: U9.7(DP) USB2.3(D+)
NetU9_8: U9.8(DM) USB2.2(D-)

Not connected (* = marked no-connect by the designer): U9 3(CPEN)* 10(EXTVBUS)*; USB2 SH(Shell)

### Library data of the parts
C108-C112 = CAP0402-CAP: as C1 on sheet mcu
R60-R62 R64 = Res2: Resistor; Value: 0Ohm; Published: 8-Jun-2000; LatestRevisionDate: 17-Jul-2002; LatestRevisionNote: Re-released for DXP Platform.; PackageReference: AXIAL-0.4; Publisher: Altium Limited; PackageDescription: Axial Device, Thru-Hole; 2 Leads; 0.4 in Pin Spacing
USB2 = USB_Micro_TypeB: as USB1 on sheet mcu; Package / Case: SMD; Supplier 1: Digi-Key; Supplier Part Number 1: WM17142CT-ND
X2 = OSCILLATOR-3.2X2.5: Crystal Oscillator in 3.2x2.5 SMD

## Sheet LNA.SchDoc
size A4
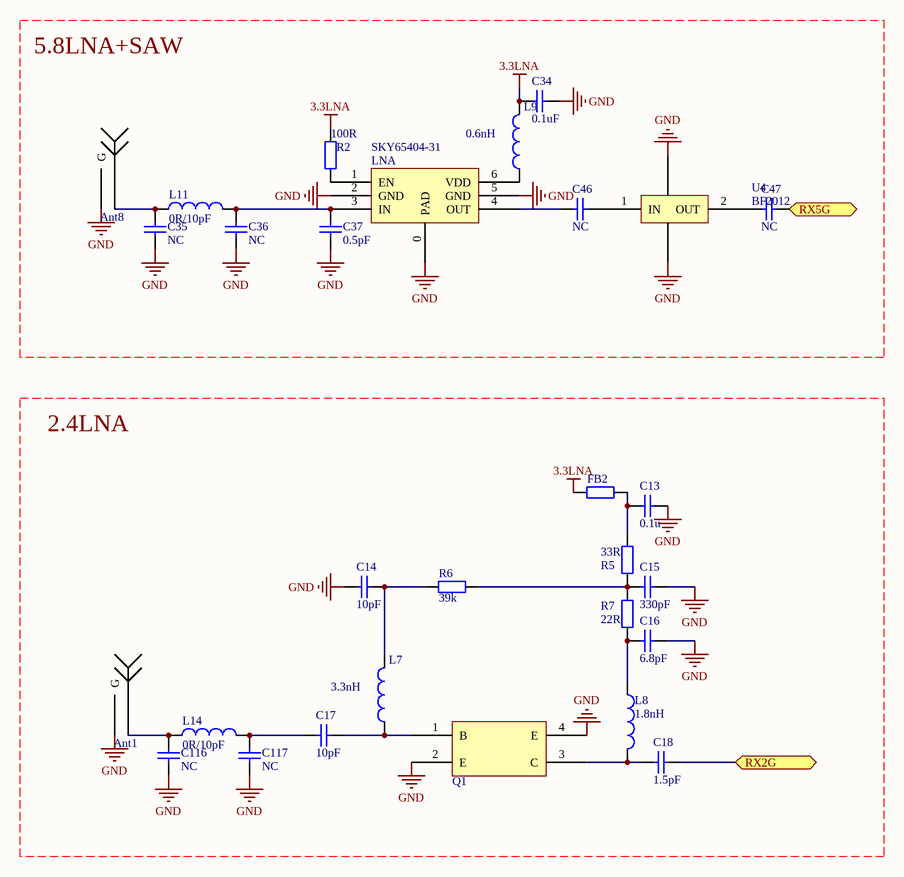
[diagram p6: LNA.SchDoc]

### Parts
Ant1  Antenna  [SMA-2]  (value not drawn)
Ant8  Antenna  [SMA-2]  (value not drawn)
C13  value 0.1u  [0402]  (hidden comment: Cap)
C14  value 10pF  [0402]  (hidden comment: Cap)
C15  value 330pF  [0402]  (hidden comment: Cap)
C16  value 6.8pF  [0402]  (hidden comment: Cap)
C17  value 10pF  [0402]  (hidden comment: Cap)
C18  value 1.5pF  [0402]  (hidden comment: Cap)
C34  value 0.1uF  [0402]  (hidden comment: Cap)
C35  value NC  [0402]  (hidden comment: Cap)
C36  value NC  [0402]  (hidden comment: Cap)
C37  value 0.5pF  [0402]  (hidden comment: Cap)
C46  value NC  [0402]  (hidden comment: Cap)
C47  value NC  [0402]  (hidden comment: Cap)
C116  value NC  [0402]  (hidden comment: Cap)
C117  value NC  [0402]  (hidden comment: Cap)
FB2  Res2  [0402]  (value not drawn)
L7  value 3.3nH  [0402]  (hidden comment: Inductor)
L8  value 1.8nH  [0402]  (hidden comment: Inductor)
L9  value 0.6nH  [0402]  (hidden comment: Inductor)
L11  value 0R/10pF  [0402]  (hidden comment: Inductor)
L14  value 0R/10pF  [0402]  (hidden comment: Inductor)
LNA  SKY65404-31  [SKY65404-31]
Q1  RF_BJT  [SOT343-4(RF)]  (value not drawn)
R2  value 100R  [0402]  (hidden comment: Res2)
R5  value 33R  [0402]  (hidden comment: Res2)
R6  value 39k  [0402]  (hidden comment: Res2)
R7  value 22R  [0402]  (hidden comment: Res2)
U4  BF2012  [LFB2H5]

### Ports
RX2G, RX5G

### Nets
3.3LNA: C34.2 FB2.1 L9.2 R2.2
GND: Ant1.GND(G) Ant8.GND(G) C13.1 C14.2 C15.2 C16.1 C34.1 C35.1 C36.1 C37.1 C116.1 C117.1 LNA.0(PAD) LNA.2(GND) LNA.5(GND) Q1.2(E) Q1.4(E) U4.0(GND)
NetAnt1_1: Ant1.1 C116.2 L14.1
NetAnt8_1: Ant8.1 C35.2 L11.1
NetC13_2: C13.2 FB2.2 R5.2
NetC14_1: C14.1 L7.2 R6.2
NetC15_1: C15.1 R5.1 R6.1 R7.1
NetC16_2: C16.2 L8.1 R7.2
NetC17_1: C17.1 L7.1 Q1.1(B)
NetC17_2: C17.2 C117.2 L14.2
NetC18_1: C18.1 ; port RX2G
NetC18_2: C18.2 L8.2 Q1.3(C)
NetC36_2: C36.2 C37.2 L11.2 LNA.3(IN)
NetC46_1: C46.1 LNA.4(OUT)
NetC46_2: C46.2 U4.1(IN)
NetC47_1: C47.1 U4.2(OUT)
NetC47_2: C47.2 ; port RX5G
NetL9_1: L9.1 LNA.6(VDD)
NetLNA_1: LNA.1(EN) R2.1

### Notes on the sheet
- 5.8LNA+SAW
- 2.4LNA

### Library data of the parts
C13-C18 C34-C37 C46 C47 C116 C117 = Cap: Capacitor; Published: 8-Jun-2000; LatestRevisionDate: 17-Jul-2002; LatestRevisionNote: Re-released for DXP Platform.; PackageReference: RAD-0.3; Publisher: Altium Limited; PackageDescription: Radial Cap, Thru-Hole; 2 Leads; 0.3 in Pin Spacing
FB2 = Res2: Resistor; Value: FB; Published: 8-Jun-2000; LatestRevisionDate: 17-Jul-2002; LatestRevisionNote: Re-released for DXP Platform.; PackageReference: AXIAL-0.4; Publisher: Altium Limited; PackageDescription: Axial Device, Thru-Hole; 2 Leads; 0.4 in Pin Spacing
L7-L9 L11 L14 = Inductor: Code_IEC: 1005; Published: 8-Jun-2000; LatestRevisionDate: 29-May-2009; LatestRevisionNote: IPC-7351 Footprint Added.; PackageReference: 0402-A; Publisher: Altium Limited; PackageDescription: Chip Inductor; Code_JEITA: 0402
R2 R5-R7 = Res2: Resistor; Published: 8-Jun-2000; LatestRevisionDate: 17-Jul-2002; LatestRevisionNote: Re-released for DXP Platform.; PackageReference: AXIAL-0.4; Publisher: Altium Limited; PackageDescription: Axial Device, Thru-Hole; 2 Leads; 0.4 in Pin Spacing

## Nets that join several sheets
3.3A: power (C50.2 U2.5), mcu (C102.2 C103.2 MCU1.13), IF (7 pins)
3.3D: power (C106.2 U8.5), mcu (15 pins), USB_HS (7 pins)
3.3LNA: power (C114.2 U10.5), LNA (C34.2 FB2.1 L9.2 R2.2)
3.3RF: power (C104.2 C124.2 U7.5), MAX2829_RF (29 pins)
5V: power (16 pins), mcu (USB1.1), PA (18 pins), USB_HS (R60.1 USB2.1)
AGND: mcu (C102.1 C103.1 MCU1.12 R59.2), IF (16 pins)
GND: power (23 pins), mcu (19 pins), MAX2829_RF (38 pins), PA (37 pins), USB_HS (12 pins), LNA (18 pins)
NetC9_1: mcu (MCU1.15), IF (C9.1 OP1.13 OP1.14)
NetC18_1: MAX2829_RF (C76.2), LNA (C18.1)
NetC33_1: mcu (MCU1.25), PA (C33.1 R15.2 U6.5)
NetC47_2: MAX2829_RF (L4.1), LNA (C47.2)
NetC52_1: IF (5 pins), MAX2829_RF (MAX.17)
NetC58_1: mcu (MCU1.14), IF (C58.1 OP1.8 OP1.9)
NetC60_1: IF (5 pins), MAX2829_RF (MAX.19)
NetC90_2: MAX2829_RF (C90.2), PA (U3.3)
NetC95_2: MAX2829_RF (C95.2), PA (U6.1)
NetC123_1: mcu (MCU1.24), PA (C123.1 R10.2 U3.10)
NetMAX_13: mcu (MCU1.28), MAX2829_RF (MAX.13)
NetMAX_16: IF (OP3.8 R27.1 R30.2), MAX2829_RF (MAX.16)
NetMAX_18: IF (OP2.8 R43.1 R46.2), MAX2829_RF (MAX.18)
NetMAX_26: mcu (MCU1.23), MAX2829_RF (MAX.26)
NetMAX_28: mcu (MCU1.35), MAX2829_RF (MAX.28)
NetMAX_29: mcu (MCU1.4), MAX2829_RF (MAX.29)
NetMAX_40: mcu (MCU1.16), MAX2829_RF (MAX.40)
NetMAX_41: mcu (MCU1.3), MAX2829_RF (MAX.41)
NetMAX_42: mcu (MCU1.2), MAX2829_RF (MAX.42)
NetMAX_43: IF (R39.1 R40.2), MAX2829_RF (MAX.43)
NetMAX_44: IF (R46.1 R47.2), MAX2829_RF (MAX.44)
NetMAX_45: IF (R23.1 R24.2), MAX2829_RF (MAX.45)
NetMAX_46: IF (R30.1 R31.2), MAX2829_RF (MAX.46)
NetMCU1_8: mcu (MCU1.8), USB_HS (U9.13)
NetMCU1_10: mcu (MCU1.10), USB_HS (U9.12)
NetMCU1_11: mcu (MCU1.11), USB_HS (U9.11)
NetMCU1_17: mcu (MCU1.17), USB_HS (U9.24)
NetMCU1_20: mcu (MCU1.20), IF (R33.2)
NetMCU1_21: mcu (MCU1.21), IF (R49.2), USB_HS (U9.14)
NetMCU1_26: mcu (MCU1.26), USB_HS (U9.23)
NetMCU1_27: mcu (MCU1.27), USB_HS (U9.22)
NetMCU1_29: mcu (MCU1.29), USB_HS (U9.21)
NetMCU1_30: mcu (MCU1.30), USB_HS (U9.20)
NetMCU1_33: mcu (MCU1.33), USB_HS (U9.19)
NetMCU1_34: mcu (MCU1.34), USB_HS (U9.18)
NetMCU1_42: mcu (MCU1.42), USB_HS (R64.1 U9.9)
NetMCU1_57: mcu (MCU1.57), USB_HS (U9.17)